# Altium schematic sheet rigidPCB.SchDoc
size A3
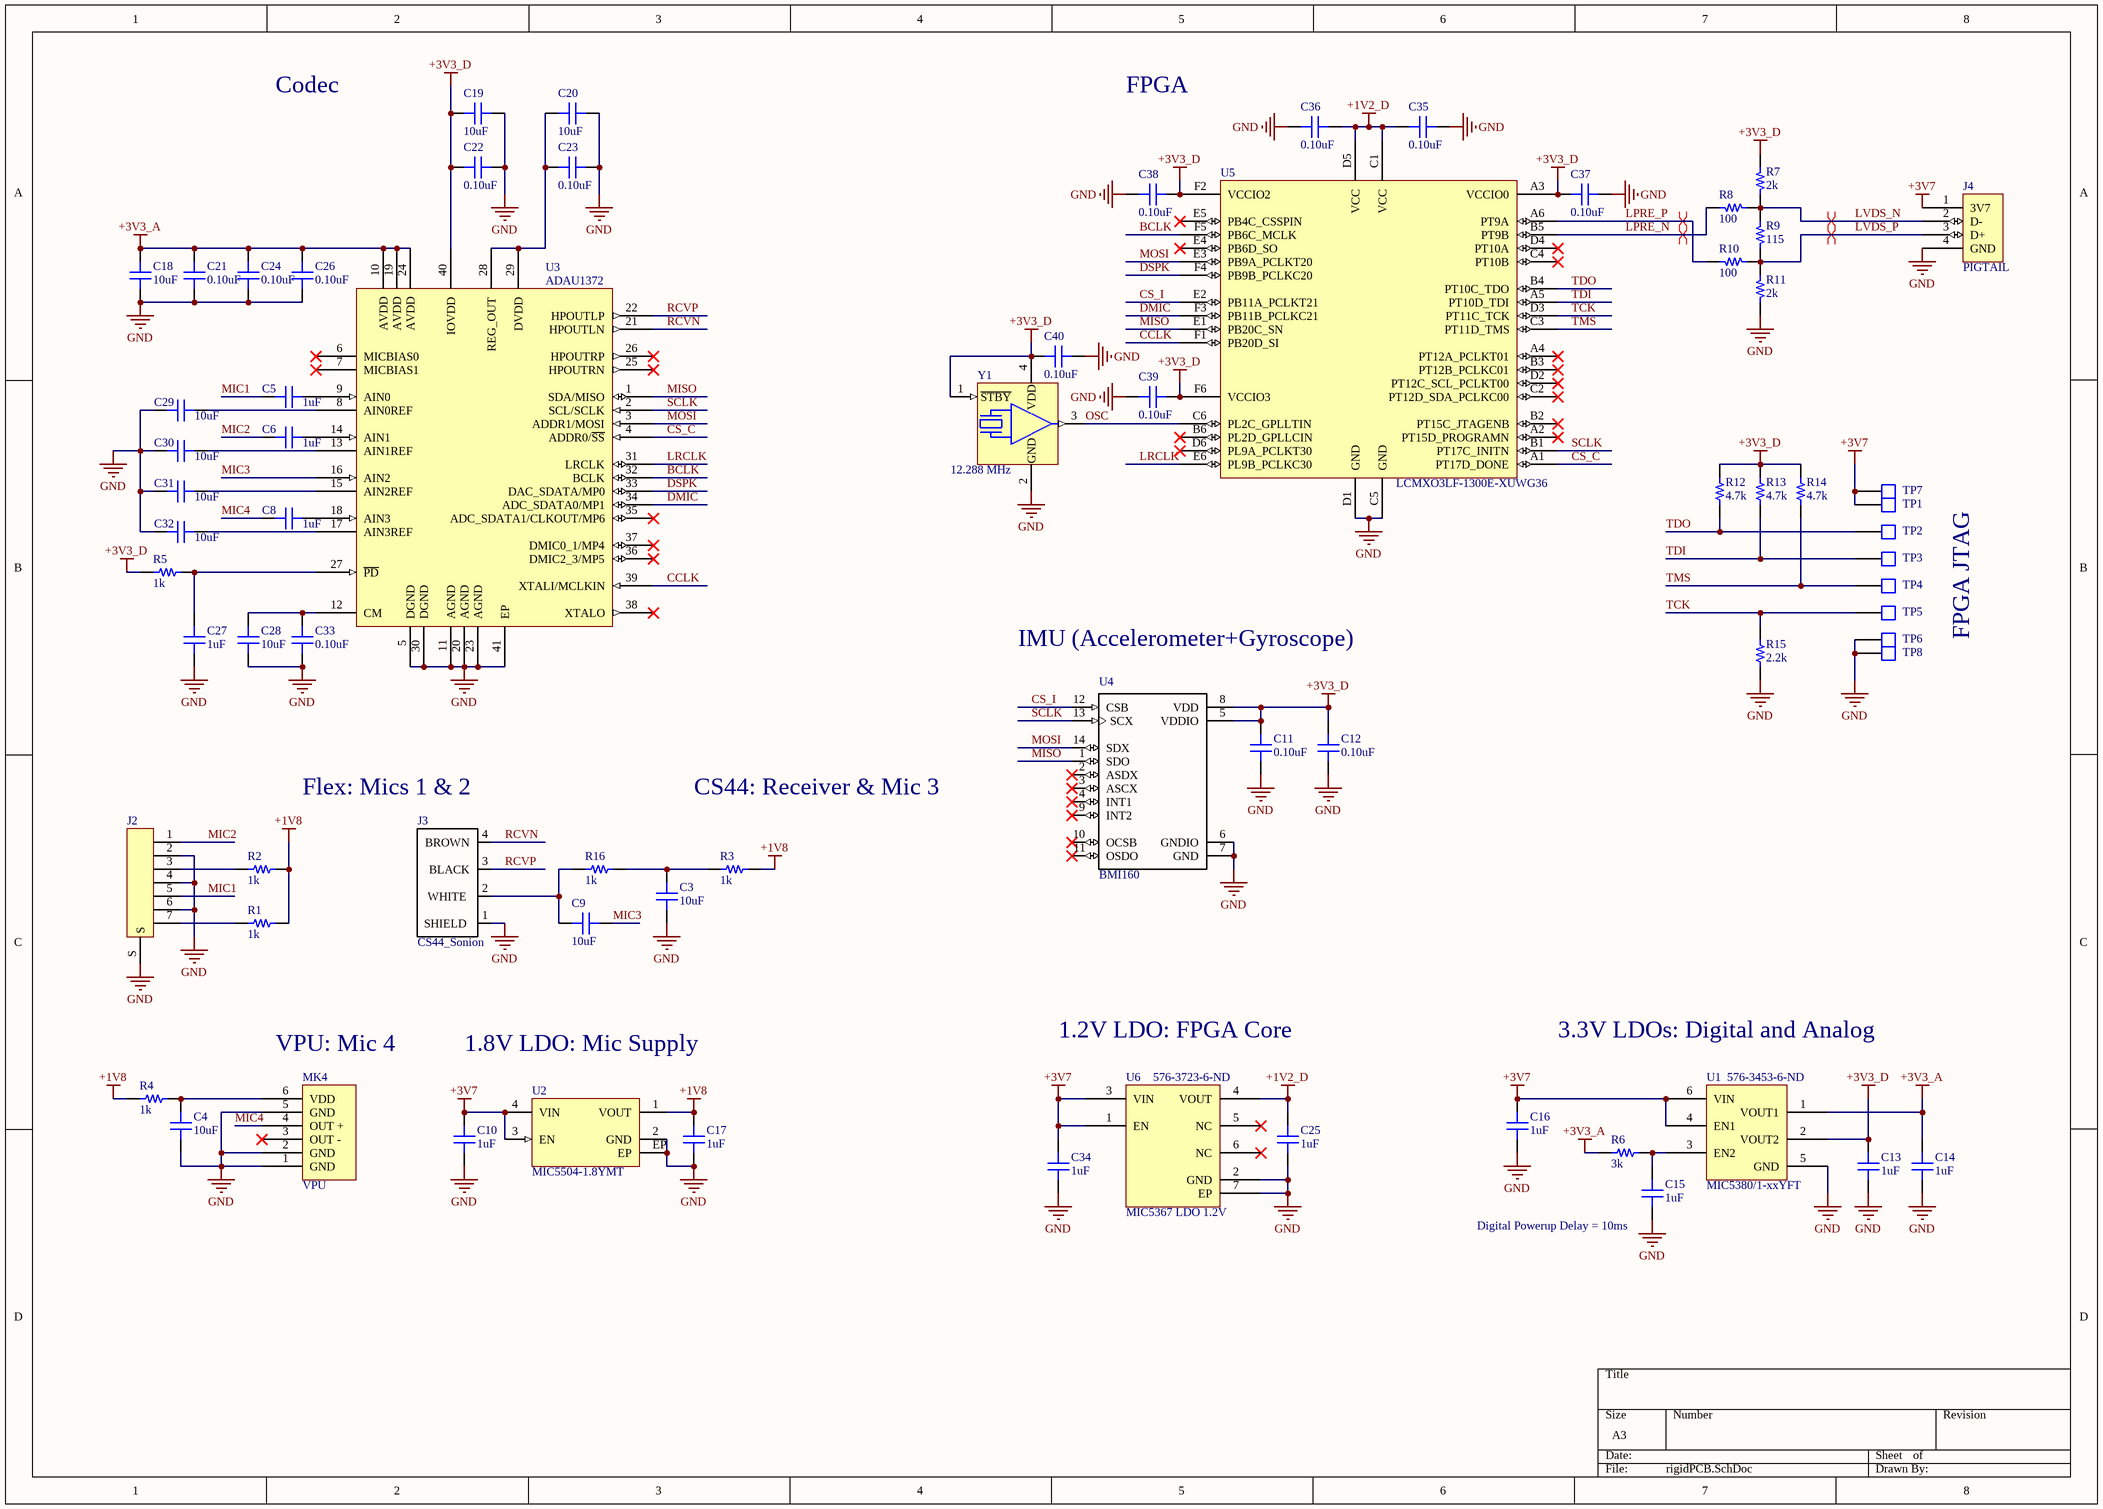
[diagram p0: rigidPCB.SchDoc]

## Parts
C3  10uF  [CAP 0402/1005]
C4  10uF  [CAP 0402/1005]
C5  1uF  [CAP 0201/0603]
C6  1uF  [CAP 0201/0603]
C8  1uF  [CAP 0201/0603]
C9  10uF  [CAP 0402/1005]
C10  1uF  [CAP 0201/0603]
C11  0.10uF  [CAP 0201/0603]
C12  0.10uF  [CAP 0201/0603]
C13  1uF  [CAP 0201/0603]
C14  1uF  [CAP 0201/0603]
C15  1uF  [CAP 0201/0603]
C16  1uF  [CAP 0201/0603]
C17  1uF  [CAP 0201/0603]
C18  10uF  [CAP 0402/1005]
C19  10uF  [CAP 0402/1005]
C20  10uF  [CAP 0402/1005]
C21  0.10uF  [CAP 0201/0603]
C22  0.10uF  [CAP 0201/0603]
C23  0.10uF  [CAP 0201/0603]
C24  0.10uF  [CAP 0201/0603]
C25  1uF  [CAP 0201/0603]
C26  0.10uF  [CAP 0201/0603]
C27  1uF  [CAP 0201/0603]
C28  10uF  [CAP 0402/1005]
C29  10uF  [CAP 0402/1005]
C30  10uF  [CAP 0402/1005]
C31  10uF  [CAP 0402/1005]
C32  10uF  [CAP 0402/1005]
C33  0.10uF  [CAP 0201/0603]
C34  1uF  [CAP 0201/0603]
C35  0.10uF  [CAP 0201/0603]
C36  0.10uF  [CAP 0201/0603]
C37  0.10uF  [CAP 0201/0603]
C38  0.10uF  [CAP 0201/0603]
C39  0.10uF  [CAP 0201/0603]
C40  0.10uF  [CAP 0201/0603]
J2  FFC  [HIROSE_FH58M-7S-0.25SHW-99]  (value not drawn)
J3  CS44_Sonion  [CS44_SOCKET_TH - EDGE - SONION]
J4  PIGTAIL  [PIGTAIL]
MK4  VPU  [VPU]
R1  1k  [RES 0201/0603]
R2  1k  [RES 0201/0603]
R3  1k  [RES 0201/0603]
R4  1k  [RES 0201/0603]
R5  1k  [RES 0201/0603]
R6  3k  [RES 0201/0603]
R7  2k  [RES 0201/0603]
R8  100  [RES 0201/0603]
R9  115  [RES 0201/0603]
R10  100  [RES 0201/0603]
R11  2k  [RES 0201/0603]
R12  4.7k  [RES 0201/0603]
R13  4.7k  [RES 0201/0603]
R14  4.7k  [RES 0201/0603]
R15  2.2k  [RES 0201/0603]
R16  1k  [RES 0201/0603]
TP1  TP_SMD_DJB  [TP_SMD_DJB]  (value not drawn)
TP2  TP_SMD_DJB  [TP_SMD_DJB]  (value not drawn)
TP3  TP_SMD_DJB  [TP_SMD_DJB]  (value not drawn)
TP4  TP_SMD_DJB  [TP_SMD_DJB]  (value not drawn)
TP5  TP_SMD_DJB  [TP_SMD_DJB]  (value not drawn)
TP6  TP_SMD_DJB  [TP_SMD_DJB]  (value not drawn)
TP7  TP_SMD_DJB  [TP_SMD_DJB]  (value not drawn)
TP8  TP_SMD_DJB  [TP_SMD_DJB]  (value not drawn)
U1  MIC5380/1-xxYFT  Supplier Part Number 1: 576-3453-6-ND  [06L FCSTSLP]
U2  MIC5504-1.8YMT  [MICREL_DFN4]
U3  ADAU1372  [QFN40_LFCSP_WQ_6mmx6mm]
U4  BMI160  [LGA14R50P5X4_300X250X83]
U5  LCMXO3LF-1300E-XUWG36  [BGA36_WLCS_25x25_MachXO3]
U6  MIC5367 LDO 1.2V  Supplier Part Number 1: 576-3723-6-ND  [LDO 1.2V]
Y1  12.288 MHz  [OSC_2.5x2.0mm]

## Nets
+1V2_D: C25.2 C35.2 C36.1 U5.C1(VCC) U5.D5(VCC) U6.4(VOUT)
+1V8: C17.2 R1.2 R2.2 R3.2 R4.1 U2.1(VOUT)
+3V3_A: C14.2 C18.1 C21.2 C24.2 C26.2 R6.1 U1.1(VOUT1) U3.10(AVDD) U3.19(AVDD) U3.24(AVDD)
+3V3_D: C11.2 C12.2 C13.2 C19.2 C22.1 C37.2 C38.1 C39.1 C40.2 R5.1 R7.2 R12.2 R13.2 R14.2 U1.2(VOUT2) U3.40(IOVDD) U4.5(VDDIO) U4.8(VDD) U5.A3(VCCIO0) U5.F2(VCCIO2) U5.F6(VCCIO3) Y1.1(~{STBY}) Y1.4(VDD)
+3V7: C10.2 C16.2 C34.2 J4.1(3V7) TP1.1 TP7.1 U1.4(EN1) U1.6(VIN) U2.3(EN) U2.4(VIN) U6.1(EN) U6.3(VIN)
GND: C3.1 C4.1 C10.1 C11.1 C12.1 C13.1 C14.1 C15.1 C16.1 C17.1 C18.2 C19.1 C20.1 C21.1 C22.2 C23.2 C24.1 C25.1 C26.1 C27.1 C28.2 C29.2 C30.2 C31.2 C32.2 C33.1 C34.1 C35.1 C36.2 C37.1 C38.2 C39.2 C40.1 J2.2 J2.4 J2.6 J2.S J3.1(SHIELD) J4.4(GND) MK4.1(GND) MK4.2(GND) MK4.5(GND) R11.1 R15.1 TP6.1 TP8.1 U1.5(GND) U2.2(GND) U2.EP U3.5(DGND) U3.11(AGND) U3.20(AGND) U3.23(AGND) U3.30(DGND) U3.41(EP) U4.6(GNDIO) U4.7(GND) U5.C5(GND) U5.D1(GND) U6.2(GND) U6.7(EP) Y1.2(GND)
BCLK: U3.32(BCLK) U5.F5(PB6C_MCLK)
CCLK: U3.39(XTALI/MCLKIN) U5.F1(PB20D_SI)
CS_C: U3.4(ADDR0/~{SS}) U5.A1(PT17D_DONE)
CS_I: U4.12(CSB) U5.E2(PB11A_PCLKT21)
DMIC: U3.34(ADC_SDATA0/MP1) U5.F3(PB11B_PCLKC21)
DSPK: U3.33(DAC_SDATA/MP0) U5.F4(PB9B_PCLKC20)
LPRE_N: R8.2 U5.B5(PT9B)
LPRE_P: R10.2 U5.A6(PT9A)
LRCLK: U3.31(LRCLK) U5.E6(PL9B_PCLKC30)
LVDS_N: J4.2(D-) R7.1 R8.1 R9.2
LVDS_P: J4.3(D+) R9.1 R10.1 R11.2
MIC1: C5.2 J2.5
MIC2: C6.2 J2.1
MIC3: C9.1 U3.16(AIN2)
MIC4: C8.2 MK4.4(OUT_+)
MISO: U3.1(SDA/MISO) U4.1(SDO) U5.E1(PB20C_SN)
MOSI: U3.3(ADDR1/MOSI) U4.14(SDX) U5.E3(PB9A_PCLKT20)
OSC: U5.C6(PL2C_GPLLTIN) Y1.3(OUT)
RCVN: J3.4(BROWN) U3.21(HPOUTLN)
RCVP: J3.3(BLACK) U3.22(HPOUTLP)
SCLK: U3.2(SCL/SCLK) U4.13(SCX) U5.B1(PT17C_INITN)
TCK: R15.2 TP5.1 U5.D3(PT11C_TCK)
TDI: R13.1 TP3.1 U5.A5(PT10D_TDI)
TDO: R12.1 TP2.1 U5.B4(PT10C_TDO)
TMS: R14.1 TP4.1 U5.C3(PT11D_TMS)
NetC3_2: C3.2 R3.1 R16.2
NetC4_2: C4.2 MK4.6(VDD) R4.2
NetC5_1: C5.1 U3.9(AIN0)
NetC6_1: C6.1 U3.14(AIN1)
NetC8_1: C8.1 U3.18(AIN3)
NetC9_2: C9.2 J3.2(WHITE) R16.1
NetC15_2: C15.2 R6.2 U1.3(EN2)
NetC20_2: C20.2 C23.1 U3.28(REG_OUT) U3.29(DVDD)
NetC27_2: C27.2 R5.2 U3.27(~{PD})
NetC28_1: C28.1 C33.2 U3.12(CM)
NetC29_1: C29.1 U3.8(AIN0REF)
NetC30_1: C30.1 U3.13(AIN1REF)
NetC31_1: C31.1 U3.15(AIN2REF)
NetC32_1: C32.1 U3.17(AIN3REF)
NetJ2_3: J2.3 R2.1
NetJ2_7: J2.7 R1.1

Not connected (* = marked no-connect by the designer): MK4 3(OUT_-)*; U3 6(MICBIAS0)* 7(MICBIAS1)* 25(HPOUTRN)* 26(HPOUTRP)* 35(ADC_SDATA1/CLKOUT/MP6)* 36(DMIC2_3/MP5)* 37(DMIC0_1/MP4)* 38(XTALO)*; U4 2(ASDX)* 3(ASCX)* 4(INT1)* 9(INT2)* 10(OCSB)* 11(OSDO)*; U5 A2(PT15D_PROGRAMN)* A4(PT12A_PCLKT01)* B2(PT15C_JTAGENB)* B3(PT12B_PCLKC01)* B6(PL2D_GPLLCIN)* C2(PT12D_SDA_PCLKC00)* C4(PT10B)* D2(PT12C_SCL_PCLKT00)* D4(PT10A)* D6(PL9A_PCLKT30)* E4(PB6D_SO)* E5(PB4C_CSSPIN)*; U6 5(NC)* 6(NC)*

## Layout directives
differential pair: LPRE_N, LPRE_P, LVDS_N, LVDS_P

## Notes on the sheet
- Codec
- FPGA
- IMU (Accelerometer+Gyroscope)
- FPGA JTAG
- (near J2) Flex: Mics 1 & 2
- (near J3) CS44: Receiver & Mic 3
- VPU: Mic 4
- 1.8V LDO: Mic Supply
- 1.2V LDO: FPGA Core
- 3.3V LDOs: Digital and Analog
- (near C15) Digital Powerup Delay = 10ms

## Library data of the parts
C3 C4 C9 C18-C20 C28-C32 = C1005X5R0J106M050BC: CAP CER 10UF 6.3V X5R 0402; Manufacturer: TDK Corporation; TemperatureRange: -55C ~ 85C; Tolerance: 20%; Value: 10uF; Part Number: C1005X5R0J106M050BC; PartId: 12380; Supplier 1: Digi-Key; Supplier Part Number 1: 445-8920-2-ND; ComponentLink1Description: Datasheet; ComponentLink1URL: https://product.tdk.com/info/en/catalog/datasheets/mlcc_commercial_general_en.pdf; ComponentLink2Description: Digi-Key Listing; ComponentLink2URL: https://www.digikey.com/product-detail/en/tdk-corporation/C1005X5R0J106M050BC/445-8920-2-ND/3507809; TemperatureCoefficient: X5R; Voltage: 6.3V; Price: 0.119; Device Package: 0402 (1005 Metric)
C5 C6 C8 C10 C13-C17 C25 C27 C34 = 02016D105MAT2A: CAP CER 1UF 6.3V X5R 0201; Manufacturer: AVX Corporation; TemperatureRange: -55C ~ 85C; Tolerance: 20%; Value: 1uF; Part Number: 02016D105MAT2A; PartId: 20442; Supplier 1: Digi-Key; Supplier Part Number 1: 478-7862-2-ND; ComponentLink1Description: Datasheet; ComponentLink1URL: http://datasheets.avx.com/cx5r.pdf; ComponentLink2Description: Digi-Key Listing; ComponentLink2URL: https://www.digikey.com/product-detail/en/avx-corporation/02016D105MAT2A/478-7862-2-ND/3079664; TemperatureCoefficient: X5R; Voltage: 6.3V; Price: 0.063; Device Package: 0201 (0603 Metric)
C11 C12 C21-C24 C26 C33 C35-C40 = CL03A104KP3NNNC: CAP CER 0.1UF 10V X5R 0201; Manufacturer: Samsung Electro-Mechanics America, Inc.; TemperatureRange: -55C ~ 85C; Tolerance: 10%; Value: 0.10uF; Part Number: CL03A104KP3NNNC; PartId: 20562; Supplier 1: Digi-Key; Supplier Part Number 1: 1276-1115-2-ND; ComponentLink1Description: Datasheet; ComponentLink1URL: http://www.samsungsem.com/kr/support/product-search/mlcc/__icsFiles/afieldfile/2016/08/18/S_CL03A104KP3NNND.pdf; ComponentLink2Description: Digi-Key Listing; ComponentLink2URL: https://www.digikey.com/product-detail/en/samsung-electro-mechanics-america-inc/CL03A104KP3NNNC/1276-1115-2-ND/3886773; TemperatureCoefficient: X5R; Voltage: 10V; Price: 0.0031; Device Package: 0201 (0603 Metric)
J2 = HIROSE_FH58M-7S-0.25SHW-99: Hirose FH58M-7S-0.25SHW(99) 7-pin Top+Bottom Contact FFC Connector
J3 = CS44_Sonion: 4-pin connector. Specify TH vs. SMD; Manufacturer: Knowles; MfgPartNumber: CS44
R1-R5 R16 = RC0201JR-071KL: RES SMD 1K OHM 5% 1/20W 0201; Manufacturer: Yageo; TemperatureRange: -55C ~ 125C; TemperatureCoefficient: 200ppm/C; PowerRating: 0.05W, 1/20W; Value: 1k; Part Number: RC0201JR-071KL; PartId: 19463; Supplier 1: Digi-Key; Supplier Part Number 1: 311-1KNTR-ND; ComponentLink1Description: Datasheet; ComponentLink1URL: http://www.yageo.com/documents/recent/PYu-RC_Group_51_RoHS_L_04.pdf; ComponentLink2Description: Digi-Key Listing; ComponentLink2URL: https://www.digikey.com/product-detail/en/yageo/RC0201JR-071KL/311-1KNTR-ND/1948922; Tolerance: 5%; Price: 0.0042; Device Package: 0201 (0603 Metric)
R6 = RC0201FR-073KL: RES SMD 3K OHM 1% 1/20W 0201; Manufacturer: Yageo; TemperatureRange: -55C ~ 125C; TemperatureCoefficient: 200ppm/C; PowerRating: 0.05W, 1/20W; Value: 3k; Part Number: RC0201FR-073KL; PartId: 19520; Supplier 1: Digi-Key; Supplier Part Number 1: YAG2656TR-ND; ComponentLink1Description: Datasheet; ComponentLink1URL: http://www.yageo.com/documents/recent/PYu-RC_Group_51_RoHS_L_04.pdf; ComponentLink2Description: Digi-Key Listing; ComponentLink2URL: https://www.digikey.com/product-detail/en/yageo/RC0201FR-073KL/YAG2656TR-ND/5280516; Tolerance: 1%; Price: 0.0042; Device Package: 0201 (0603 Metric)
R7 R11 = RC0201FR-072KL: RES SMD 2K OHM 1% 1/20W 0201; Manufacturer: Yageo; TemperatureRange: -55C ~ 125C; TemperatureCoefficient: 200ppm/C; PowerRating: 0.05W, 1/20W; Value: 2k; Part Number: RC0201FR-072KL; PartId: 19505; Supplier 1: Digi-Key; Supplier Part Number 1: YAG2280TR-ND; ComponentLink1Description: Datasheet; ComponentLink1URL: http://www.yageo.com/documents/recent/PYu-RC_Group_51_RoHS_L_04.pdf; ComponentLink2Description: Digi-Key Listing; ComponentLink2URL: https://www.digikey.com/product-detail/en/yageo/RC0201FR-072KL/YAG2280TR-ND/3202400; Tolerance: 1%; Price: 0.0042; Device Package: 0201 (0603 Metric)
R8 R10 = RC0603F101CS: RES SMD 100 OHM 1% 1/20W 0201; Manufacturer: Samsung Electro-Mechanics America, Inc.; TemperatureRange: -55C ~ 125C; TemperatureCoefficient: 250ppm/C; PowerRating: 0.05W, 1/20W; Value: 100; Part Number: RC0603F101CS; PartId: 19787; Supplier 1: Digi-Key; Supplier Part Number 1: 1276-3601-2-ND; ComponentLink1Description: Datasheet; ComponentLink1URL: //media.digikey.com/pdf/Data%20Sheets/Samsung%20PDFs/RC_Series_ds.pdf; ComponentLink2Description: Digi-Key Listing; ComponentLink2URL: https://www.digikey.com/product-detail/en/samsung-electro-mechanics-america-inc/RC0603F101CS/1276-3601-2-ND/3963908; Tolerance: 1%; Price: 0.0081; Device Package: 0201 (0603 Metric)
R9 = RC0201FR-07115RL: RES SMD 115 OHM 1% 1/20W 0201; Manufacturer: Yageo; TemperatureRange: -55C ~ 125C; TemperatureCoefficient: 200ppm/C; PowerRating: 0.05W, 1/20W; Value: 115; Part Number: RC0201FR-07115RL; PartId: 20289; Supplier 1: Digi-Key; Supplier Part Number 1: YAG2383TR-ND; ComponentLink1Description: Datasheet; ComponentLink1URL: http://www.yageo.com/documents/recent/PYu-RC_Group_51_RoHS_L_04.pdf; ComponentLink2Description: Digi-Key Listing; ComponentLink2URL: https://www.digikey.com/product-detail/en/yageo/RC0201FR-07115RL/YAG2383TR-ND/5280243; Tolerance: 1%; Price: 0.0042; Device Package: 0201 (0603 Metric)
R12-R14 = RC0201FR-074K7L: RES SMD 4.7K OHM 1% 1/20W 0201; Manufacturer: Yageo; TemperatureRange: -55C ~ 125C; TemperatureCoefficient: 200ppm/C; PowerRating: 0.05W, 1/20W; Value: 4.7k; Part Number: RC0201FR-074K7L; PartId: 19526; Supplier 1: Digi-Key; Supplier Part Number 1: 311-4.70KMTR-ND; ComponentLink1Description: Datasheet; ComponentLink1URL: http://www.yageo.com/documents/recent/PYu-RC_Group_51_RoHS_L_04.pdf; ComponentLink2Description: Digi-Key Listing; ComponentLink2URL: https://www.digikey.com/product-detail/en/yageo/RC0201FR-074K7L/311-4.70KMTR-ND/1948894; Tolerance: 1%; Price: 0.0056; Device Package: 0201 (0603 Metric)
R15 = RC0603F222CS: RES SMD 2.2K OHM 1% 1/20W 0201; Manufacturer: Samsung Electro-Mechanics America, Inc.; TemperatureRange: -55C ~ 125C; TemperatureCoefficient: 250ppm/C; PowerRating: 0.05W, 1/20W; Value: 2.2k; Part Number: RC0603F222CS; PartId: 19542; Supplier 1: Digi-Key; Supplier Part Number 1: 1276-3634-2-ND; ComponentLink1Description: Datasheet; ComponentLink1URL: //media.digikey.com/pdf/Data%20Sheets/Samsung%20PDFs/RC_Series_ds.pdf; ComponentLink2Description: Digi-Key Listing; ComponentLink2URL: https://www.digikey.com/product-detail/en/samsung-electro-mechanics-america-inc/RC0603F222CS/1276-3634-2-ND/3963941; Tolerance: 1%; Price: 0.0019; Device Package: 0201 (0603 Metric)
TP1-TP8 = TP_SMD_DJB: Digital Jellybean Style SMD Test Point; DNP: DNP
U1 = MIC5380/1-xxYFT: LDO 2fixed Outputs; Supplier 1: Digi-Key
U2 = MICREL_MIC5504-1.8YMT: Micrel MIC5504-1.8YMT 1.8V 300mA LDO
U3 = ADAU1372: Analog Devices CODEC
U4 = BMI160_1: BMI160 2.5 x 3 mm Tiaxial Accelerometer / Gyroscope Inertial Measurement Unit; MF: Bosch; Availability: Good; Package: LGA-14 Bosch; Price: 3.29 USD; MP: BMI160; Value: *
U5 = LCMXO3LF-1300E-XUWG36: Lattice MachXO3 36-ball 2.5x2.5mm FPGA
Y1 = MC_DSC1033DI2-012.2880: Microchip 12.288 MHz SMD MEMS Oscillator; DIGIKEY_PN: DSC1033DI2-012.2880-ND
U6 = MIC5367 LDO 1.2V: Supplier 1: Digi-Key